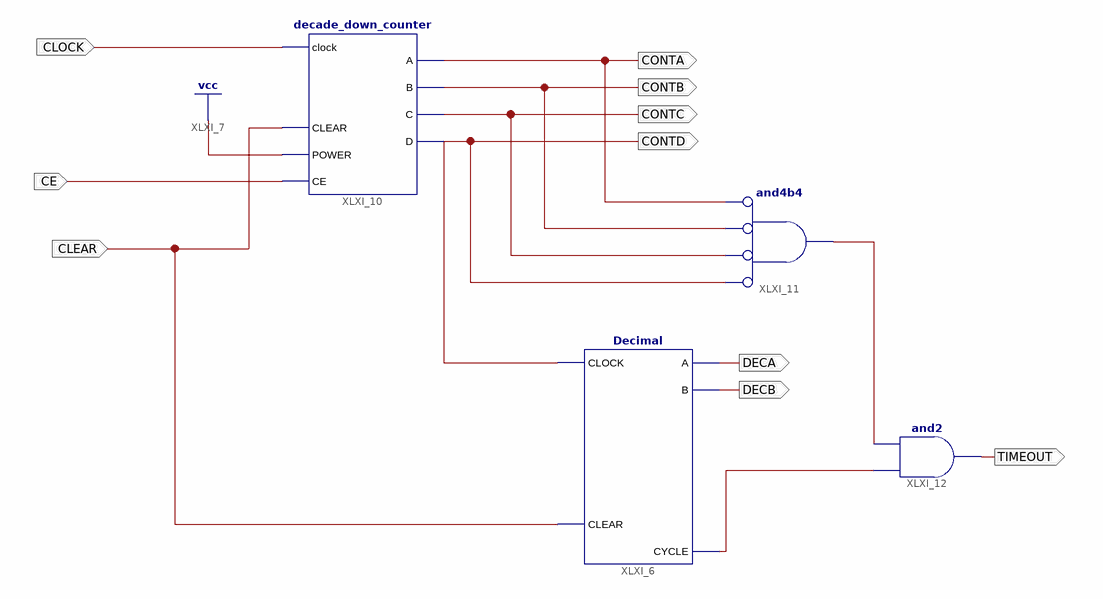
[diagram p0: schematic sheet 1]
// Xilinx ISE schematic TimerBlock.sch (spartan3) as structural Verilog: 4 symbols, 10 ports
module TimerBlock (
  input  CLEAR,
  input  CLOCK,
  input  CE,
  output CONTD,
  output DECA,
  output DECB,
  output CONTA,
  output CONTB,
  output CONTC,
  output TIMEOUT
);

  wire XLXN_11, XLXN_12;

  Decimal XLXI_6 (.CLOCK(CONTD), .CLEAR(CLEAR), .CYCLE(XLXN_11), .B(DECB), .A(DECA));
  decade_down_counter XLXI_10 (
    .clock(CLOCK), .POWER(1'b1), .CLEAR(CLEAR), .C(CONTC), .D(CONTD), .B(CONTB), .A(CONTA), .CE(CE));
  and XLXI_11 (XLXN_12, ~CONTD, ~CONTC, ~CONTB, ~CONTA);  // and4b4
  and XLXI_12 (TIMEOUT, XLXN_11, XLXN_12);
endmodule
